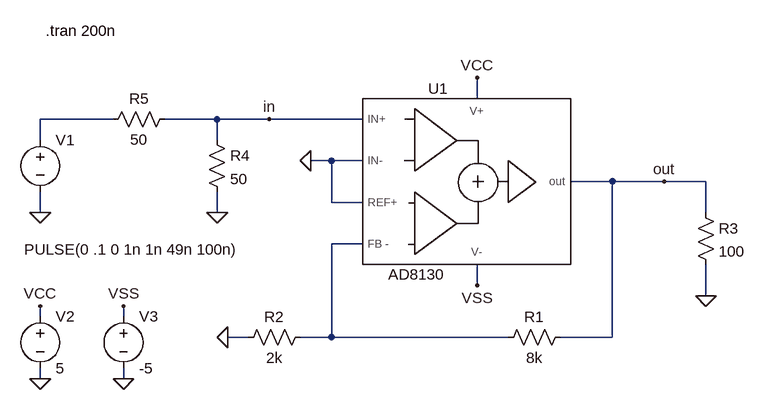
[diagram p0: schematic AD8130_test.asc]
AD8130_test.asc, the LTspice schematic file:
Version 4
SHEET 1 880 680
WIRE 352 80 352 48
WIRE -208 112 -320 112
WIRE -48 112 -128 112
WIRE 32 112 -48 112
WIRE 176 112 32 112
WIRE -320 144 -320 112
WIRE -48 144 -48 112
WIRE 128 176 96 176
WIRE 176 176 128 176
WIRE 560 208 496 208
WIRE 640 208 560 208
WIRE 704 208 640 208
WIRE 128 240 128 176
WIRE 176 240 128 240
WIRE -320 256 -320 224
WIRE -48 256 -48 224
WIRE 704 256 704 208
WIRE 176 304 128 304
WIRE 352 368 352 336
WIRE 704 384 704 336
WIRE -320 416 -320 400
WIRE -192 416 -192 400
WIRE 0 448 -32 448
WIRE 128 448 128 304
WIRE 128 448 80 448
WIRE 400 448 128 448
WIRE 560 448 560 208
WIRE 560 448 480 448
WIRE -320 512 -320 496
WIRE -192 512 -192 496
FLAG -320 256 0
FLAG 352 48 VCC
FLAG 352 368 VSS
FLAG -32 448 0
FLAG 704 384 0
FLAG -48 256 0
FLAG -192 512 0
FLAG -320 512 0
FLAG -320 400 VCC
FLAG -192 400 VSS
FLAG 96 176 0
FLAG 640 208 out
FLAG 32 112 in
SYMBOL AD8130 288 208 R0
SYMATTR InstName U1
SYMBOL res 384 464 R270
WINDOW 0 32 56 VTop 0
WINDOW 3 0 56 VBottom 0
SYMATTR InstName R1
SYMATTR Value 8k
SYMBOL res -16 464 R270
WINDOW 0 32 56 VTop 0
WINDOW 3 0 56 VBottom 0
SYMATTR InstName R2
SYMATTR Value 2k
SYMBOL res 688 240 R0
SYMATTR InstName R3
SYMATTR Value 100
SYMBOL res -64 128 R0
SYMATTR InstName R4
SYMATTR Value 50
SYMBOL voltage -320 128 R0
WINDOW 3 -25 185 Left 0
WINDOW 123 0 0 Left 0
WINDOW 39 0 0 Left 0
SYMATTR InstName V1
SYMATTR Value PULSE(0 .1 0 1n 1n 49n 100n)
SYMBOL res -224 128 R270
WINDOW 0 32 56 VTop 0
WINDOW 3 0 56 VBottom 0
SYMATTR InstName R5
SYMATTR Value 50
SYMBOL voltage -320 400 R0
SYMATTR InstName V2
SYMATTR Value 5
SYMBOL voltage -192 400 R0
SYMATTR InstName V3
SYMATTR Value -5
TEXT -312 -24 Left 0 !.tran 200n

The netlist it stands for:
* AD8130_test.asc
XU1 in 0 0 N002 VCC VSS out AD8130  ; pins IN+ IN- REF+ FB_- V+ V- out
R1 N002 out 8k
R2 0 N002 2k
R3 out 0 100
R4 in 0 50
V1 N001 0 PULSE(0 .1 0 1n 1n 49n 100n)
R5 N001 in 50
V2 VCC 0 5
V3 VSS 0 -5
.tran 200n
.lib ad8130.cir
.backanno
.end